# EasyEDA Pro project 工科.eprj

# Schematic Schematic1
Create Date: 2024-07-19; Page Name: P1; Project Name: 工科; Schematic Name: Schematic1; Update Date: 2024-08-10; Company: 嘉立创EDA; Page Size: A4; Version: V1.0
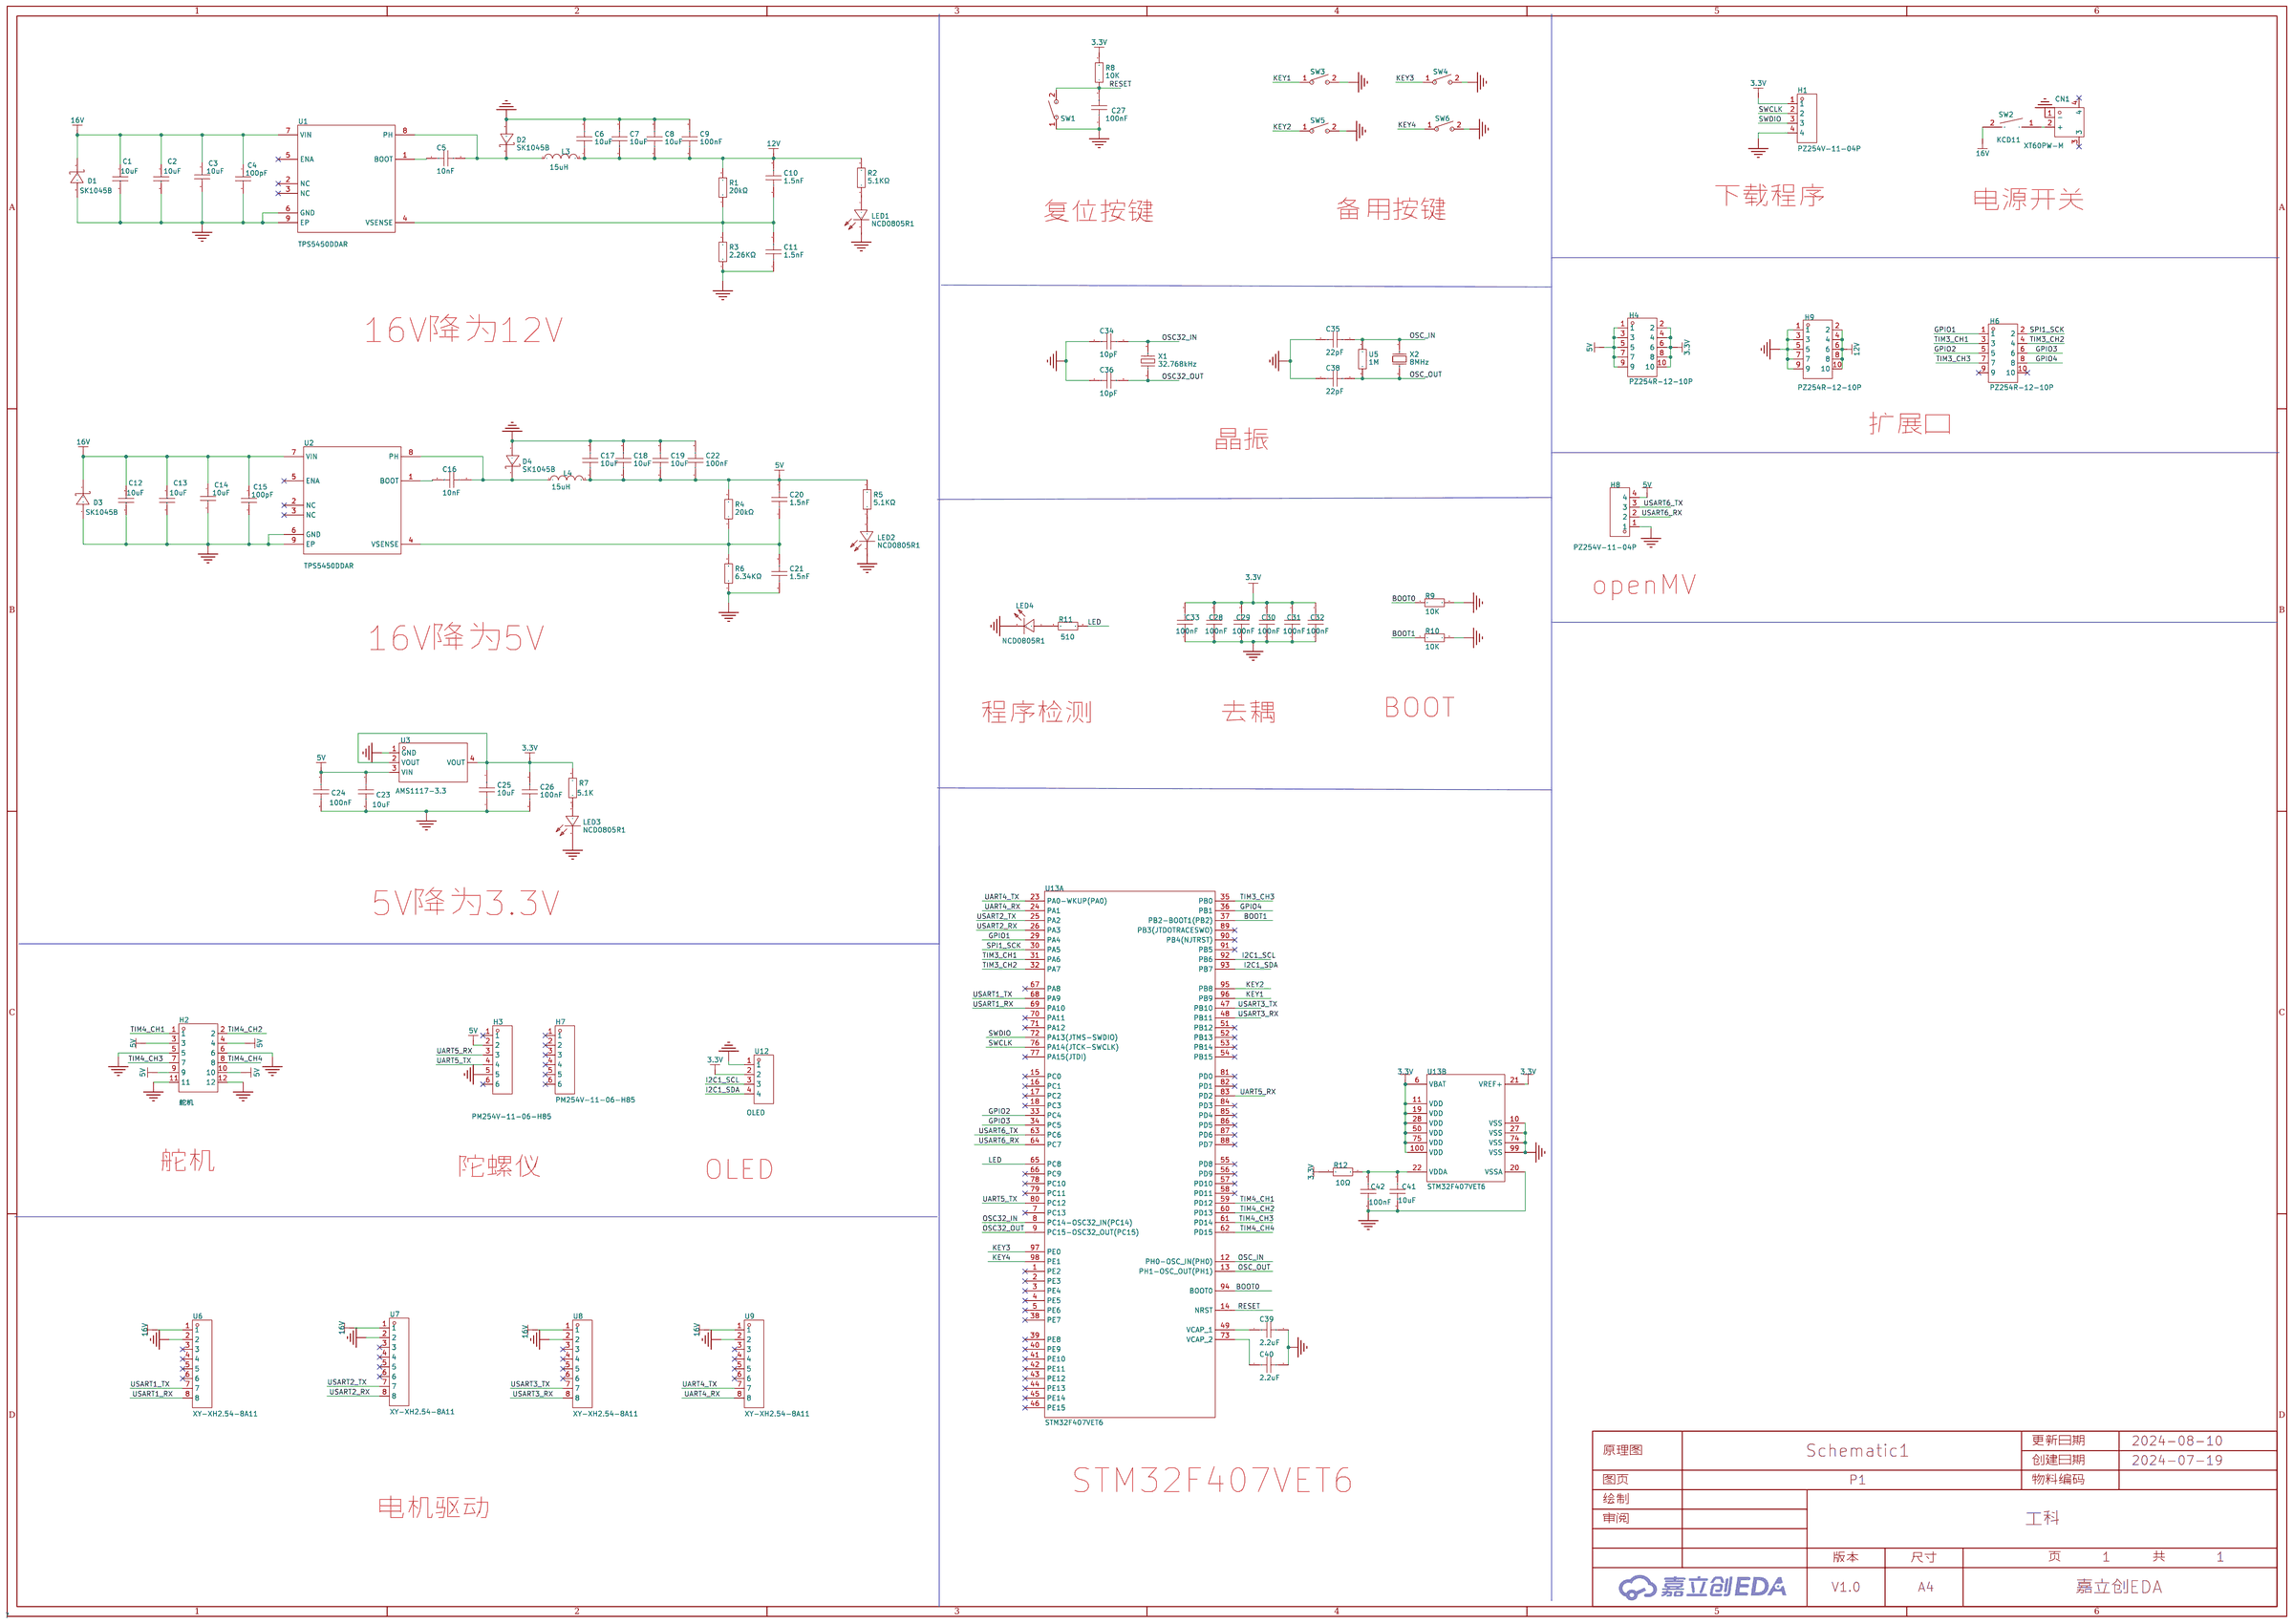
[diagram p0: schematic sheet]

## Parts
C1  10uF  [C0805]
C2  10uF  [C0805]
C3  10uF  [C0805]
C4  100pF  [C0805]
C5  10nF  [C0805]
C6  10uF  [C0805]
C7  10uF  [C0805]
C8  10uF  [C0805]
C9  100nF  [C0805]
C10  1.5nF  [C0805]
C11  1.5nF  [C0805]
C12  10uF  [C0805]
C13  10uF  [C0805]
C14  10uF  [C0805]
C15  100pF  [C0805]
C16  10nF  [C0805]
C17  10uF  [C0805]
C18  10uF  [C0805]
C19  10uF  [C0805]
C20  1.5nF  [C0805]
C21  1.5nF  [C0805]
C22  100nF  [C0805]
C23  10uF  [C0805]
C24  100nF  [C0805]
C25  10uF  [C0805]
C26  100nF  [C0805]
C27  100nF  [C0805]
C28  100nF  [C0805]
C29  100nF  [C0805]
C30  100nF  [C0805]
C31  100nF  [C0805]
C32  100nF  [C0805]
C33  100nF  [C0805]
C34  10pF  [C0805]
C35  22pF  [C0805]
C36  10pF  [C0805]
C38  22pF  [C0805]
C39  2.2uF  [C0805]
C40  2.2uF  [C0805]
C41  10uF  [C0805]
C42  100nF  [C0805]
CN1  XT60PW-M  [CONN-TH_XT60PW-M]
D1  SK1045B  [SMB_L4.6-W3.6-LS5.3-RD]
D2  SK1045B  [SMB_L4.6-W3.6-LS5.3-RD]
D3  SK1045B  [SMB_L4.6-W3.6-LS5.3-RD]
D4  SK1045B  [SMB_L4.6-W3.6-LS5.3-RD]
H1  PZ254V-11-04P  [HDR-TH_4P-P2.54-V-M]
H2  舵机  [HDR-TH_12P-P2.54-H-M-R2-C6-S2.54]
H3  PM254V-11-06-H85  [HDR-TH_6P-P2.54-V-F]
H4  PZ254R-12-10P  [HDR-TH_10P-P2.54-H-M-R2-C5-S2.54]
H6  PZ254R-12-10P  [HDR-TH_10P-P2.54-H-M-R2-C5-S2.54]
H7  PM254V-11-06-H85  [HDR-TH_6P-P2.54-V-F]
H8  PZ254V-11-04P  [HDR-TH_4P-P2.54-V-M]
H9  PZ254R-12-10P  [HDR-TH_10P-P2.54-H-M-R2-C5-S2.54]
L3  15uH  [IND-SMD_L11.5-W10.0_APS10A40]
L4  15uH  [IND-SMD_L11.5-W10.0_APS10A40]
LED1  NCD0805R1  [LED0805-R-RD]
LED2  NCD0805R1  [LED0805-R-RD]
LED3  NCD0805R1  [LED0805-R-RD]
LED4  NCD0805R1  [LED0805-R-RD]
R1  20kΩ  [R0805]
R2  5.1KΩ  [R0805]
R3  2.26KΩ  [R0805]
R4  20kΩ  [R0805]
R5  5.1KΩ  [R0805]
R6  6.34KΩ  [R0805]
R7  5.1K  [R0805]
R8  10K  [R0805]
R9  10K  [R0805]
R10  10K  [R0805]
R11  510  [R0805]
R12  10Ω  [R0805]
SW1  轻触按键3*6*2.5  [SW-SMD_L6.0-W3.6-LS8.0]
SW2  KCD11  [SW-TH_RS601HL-1010011BB]
SW3  轻触按键3*6*2.5  [SW-SMD_L6.0-W3.6-LS8.0]
SW4  轻触按键3*6*2.5  [SW-SMD_L6.0-W3.6-LS8.0]
SW5  轻触按键3*6*2.5  [SW-SMD_L6.0-W3.6-LS8.0]
SW6  轻触按键3*6*2.5  [SW-SMD_L6.0-W3.6-LS8.0]
U1  TPS5450DDAR  [SOP-8_L4.9-W3.9-P1.27-LS6.0-BL-EP]
U2  TPS5450DDAR  [SOP-8_L4.9-W3.9-P1.27-LS6.0-BL-EP]
U3  AMS1117-3.3  [SOT-223-3_L6.5-W3.4-P2.30-LS7.0-BR]
U5  1M  [R0805]
U6  XY-XH2.54-8A11  [HDR-TH_8P-P2.50-V-F-2]
U7  XY-XH2.54-8A11  [HDR-TH_8P-P2.50-V-F-2]
U8  XY-XH2.54-8A11  [HDR-TH_8P-P2.50-V-F-2]
U9  XY-XH2.54-8A11  [HDR-TH_8P-P2.50-V-F-2]
U12  OLED  [HDR-TH_4P-P2.54-H-F-W10.0-N]
U13  STM32F407VET6  [LQFP-100_L14.0-W14.0-P0.50-LS16.0-BL]  (sections 1,2)
X1  32.768kHz  [OSC-SMD_L3.2-W1.5]
X2  8MHz  [HC-49US_L11.5-W4.5-P4.88]

## Library data of the parts
C1-C4 C12-C15 = CC0805KRX7R9BB104: 容值:100nF;精度:±10%;额定电压:50V;材质(温度系数):X7R;; LCSC Part Name: 100nF ±10% 50V; Supplier Part: C49678; Manufacturer: YAGEO(国巨); Supplier Footprint: 0805; JLCPCB Part Class: 基础库; Datasheet: https://atta.szlcsc.com/upload/public/pdf/source/20180224/C181747_15194369449651363981.pdf; Supplier: LCSC; Tolerance: ±10%; Voltage Rated: 50V; Temperature Coefficient: X7R
C5-C11 C16-C36 C38-C42 = CAP_0805: Supplier Footprint: 0805
CN1 = XT60PW-M: 类别:-;类型1:-;; LCSC Part Name: AMASS(艾迈斯)航模插头xt60连接器150公母对接pw锂电池公头 板插卧式XT60PW-M; Supplier Part: C98732; Manufacturer: AMASS(艾迈斯); JLCPCB Part Class: 扩展库; Datasheet: https://atta.szlcsc.com/upload/public/pdf/source/20240118/44A3DCFF53BE25DC65378AFFB21277A4.pdf; Supplier: LCSC; Brand: 艾迈斯; Type: 卧式插头; Colour: 黄色; InterfaceType: 公头
D1-D4 = SK1045B: 二极管配置:独立式;正向压降(Vf):550mV@10A;直流反向耐压(Vr):45V;整流电流:10A;; LCSC Part Name: 电压:45V 电流:10A; Supplier Part: C65017; Manufacturer: MDD(辰达半导体); Supplier Footprint: SMB(DO-214AA); JLCPCB Part Class: 扩展库; Datasheet: https://atta.szlcsc.com/upload/public/pdf/source/20230314/9F031E71083C97B2A85075FA90CCC433.pdf; Supplier: LCSC; Diode Configuration: 独立式; Forward Voltage (Vf@If): 550mV@10A; Reverse Voltage (Vr): 45V; Rectified Current: 10A; Reverse Leakage Current (Ir): 1mA@45V@45V
H1 H8 = PZ254V-11-04P: 插针结构:1x4P;间距:2.54mm;行距:-;圆针/方针:方针;安装类型:直插;排数:单排;总PIN位数:4P;额定电流:3A;额定电压:250V;配合针长度:6mm;塑高:2.5mm;端接针长度:3mm;触头材质:-;工作温度范围:-40℃~+105℃;颜色:黑色;; LCSC Part Name: 间距:2.54mm 1x4P 直插 方针; Supplier Part: C2691448; Manufacturer: XFCN(兴飞); Supplier Footprint: 插件,P=2.54mm; JLCPCB Part Class: 扩展库; Datasheet: https://atta.szlcsc.com/upload/public/pdf/source/20200309/C492403_F9F19131791D08044AD4F84F8E751A34.pdf; Supplier: LCSC; Pin Structure: 1x4P; Pitch: 2.54mm; Circluar Pins/Square Pins: 方针; Mounting Type: 直插; Number of Rows: 单排; Number of Pins: 4P; Current Rating (Max): 3A; Voltage Rating (Max): 250V; Length of Mating Pin: 6mm; Insulation Height: 2.5mm; Length of End Connection Pin: 3mm; Operating Temperature Range: -40℃~+105℃; Color: 黑色
H2 = PZ254R-12-12P: 插针结构:2x6P;间距:2.54mm;行距:2.54mm;圆针/方针:方针;安装类型:弯插;排数:双排;总PIN位数:12P;额定电流:-;额定电压:-;配合针长度:6mm;塑高:2.5mm;触头材质:黄铜;触头镀层:-;工作温度范围:-40℃~+105℃;颜色:黑色;; LCSC Part Name: 间距:2.54mm 2x6P 弯插 方针; Supplier Part: C492434; Manufacturer: XFCN(兴飞); Supplier Footprint: 弯插,P=2.54mm; JLCPCB Part Class: 扩展库; Datasheet: https://atta.szlcsc.com/upload/public/pdf/source/20200309/C492434_8FF69D1295D71AC99A4B0B951ADD15B8.pdf; Supplier: LCSC; Pin Structure: 2x6P; Pitch: 2.54mm; Row Spacing: 2.54mm; Circluar Pins/Square Pins: 方针; Mounting Type: 弯插; Number of Rows: 双排; Number of Pins: 12P; Length of Mating Pin: 6mm; Insulation Height: 2.5mm; Contact Material: 黄铜; Operating Temperature Range: -40℃~+105℃; Color: 黑色
H3 H7 = PM254V-11-06-H85: 插孔结构:1x6P;间距:2.54mm;行距:-;圆孔/方孔:方孔;安装类型:直插;排数:单排;总孔位数:6P;额定电流:3A;额定电压:250V;插孔方向:顶部;塑高:-;工作温度范围:-40℃~+105℃;; LCSC Part Name: 间距:2.54mm 1x6P 直插; Supplier Part: C2832269; Manufacturer: XFCN(兴飞); Supplier Footprint: 插件,P=2.54mm; JLCPCB Part Class: 扩展库; Datasheet: https://atta.szlcsc.com/upload/public/pdf/source/20210514/C2832269_B3EC97736B37C2783BDCE3050AA57447.pdf; Supplier: LCSC; Holes Structure: 1x6P; Pitch: 2.54mm; Circular Hole / Square Hole: 方孔; Mounting Type: 直插; Number of Rows: 单排; Number of Holes: 6P; Current Rating (Max): 3A; Voltage Rating (Max): 250V; Holes Direction: 顶部; Operating Temperature Range: -40℃~+105℃
H4 H6 H9 = PZ254R-12-10P: 插针结构:2x5P;间距:2.54mm;行距:2.54mm;圆针/方针:方针;安装类型:弯插;排数:双排;总PIN位数:10P;额定电流:-;额定电压:-;配合针长度:6mm;塑高:2.5mm;触头材质:黄铜;触头镀层:-;工作温度范围:-40℃~+105℃;颜色:黑色;; LCSC Part Name: 间距:2.54mm 2x5P 弯插 方针; Supplier Part: C492433; Manufacturer: XFCN(兴飞); Supplier Footprint: 弯插,P=2.54mm; JLCPCB Part Class: 扩展库; Datasheet: https://atta.szlcsc.com/upload/public/pdf/source/20200309/C492433_E1DF9BC45CD746DC26B2517D82EEBDA7.pdf; Supplier: LCSC; Pin Structure: 2x5P; Pitch: 2.54mm; Row Spacing: 2.54mm; Circluar Pins/Square Pins: 方针; Mounting Type: 弯插; Number of Rows: 双排; Number of Pins: 10P; Length of Mating Pin: 6mm; Insulation Height: 2.5mm; Contact Material: 黄铜; Operating Temperature Range: -40℃~+105℃; Color: 黑色
L3 L4 = APS10A40M150: 电感值:15uH;精度:±20%;额定电流:6.55A;饱和电流(Isat):7A;; LCSC Part Name: 15uH ±20% 7A; Supplier Part: C253615; Manufacturer: Coilank(驰兴电感); Supplier Footprint: SMD; JLCPCB Part Class: 扩展库; Datasheet: https://atta.szlcsc.com/upload/public/pdf/source/20230512/EB4395A51C83803B0ABA506A98EDA969.pdf; Supplier: LCSC; Tolerance: ±20%; Rated Current: 6.55A; Saturation Current (Isat): 7A; DC Resistance (DCR): 44.5mΩ; Ratings: AEC-Q200
LED1-LED4 = NCD0805R1: 灯头类型:-;发光颜色:红色;正向电压(VF):1.6V~2.6V;功率:65mW;正向电流:20mA;主波长:615nm~630nm;二极管配置:独立二极管;透镜颜色:无色透明透镜;色温:-;发光强度:67mcd~195mcd;发光角度:130°;载带方式:-;工作温度:-30℃~+85℃;; Supplier Part: C84256; Manufacturer: 国星光电; Supplier Footprint: 0805; JLCPCB Part Class: 基础库; Datasheet: https://atta.szlcsc.com/upload/public/pdf/source/20200820/C84256_F0A75A43B3EAD75808600A0514C76B99.pdf; Supplier: LCSC; Emitted Color: 红色; Forward Voltage (VF): 1.6V~2.6V; Power Dissipation: 65mW; Forward Current: 20mA; Dominant Wavelength: 615nm~630nm; Diode Configuration: 独立二极管; Lens Color: 无色透明透镜; Luminous Intensity: 67mcd~195mcd; Viewing Angle: 130°; Operating Temperature: -30℃~+85℃
R1-R12 U5 = Res_0805: Supplier Footprint: 0805
SW1 SW3-SW6 = 轻触按键3*6*2.5: Supplier Part: C9900013040; Supplier Footprint: KEY; JLCPCB Part Class: 扩展库; Supplier: LCSC
SW2 = RS601HL-1010011BB: 带灯:无;引脚样式:焊片;额定电流:3A;额定电压(AC):250V;额定电压(DC):-;电路结构:单刀单掷;机械寿命:1万次;; Supplier Part: C2885782; Manufacturer: HCTL(华灿天禄); Supplier Footprint: 插件; JLCPCB Part Class: 扩展库; Datasheet: https://atta.szlcsc.com/upload/public/pdf/source/20210820/B1970E40D09304D7FA648AE2099FB3E8.pdf; Supplier: LCSC; Switch Length: 15mm; Switch Width: 10.5mm; Switch Height: 11.7mm; Actuator Type: 凹面弯曲; With Lamp: 无; Pin Style: 焊片; Actuator Color: 黑色; Contact Current: 3A; Voltage Rating (AC): 250V; Circuit: 单刀单掷; Mechanical Life: 1万次; Operating Temperature: -25℃~+85℃; Actuator Identifier: - O
U1 U2 = TPS5450DDAR: 功能类型:降压型;输出类型:可调;输入电压:5.5V~36V;输出电压:1.221V~31.32V;输出电流(最大值):5A;; Supplier Part: C114425; Manufacturer: TI(德州仪器); Supplier Footprint: SOP-8-EP-150mil; JLCPCB Part Class: 扩展库; Datasheet: https://www.ti.com/cn/lit/gpn/tps5450; Supplier: LCSC; Function: 降压型; Output Type: 可调; Input Voltage: 5.5V~36V; Output Voltage: 1.221V~31.32V; Output Current (Max): 5A; Switching Frequency: 500kHz; Operating Temperature: -40℃~+125℃@(TJ); Synchronous Rectification: 否; Number of Outputs: 1; Topology: 降压式; Switch tube (built-in/external): 内置
U3 = AMS1117-3.3_C6186: 输出类型:固定;最大输入电压:-;输出电压:3.3V;最大输出电流:1A;电源纹波抑制比(PSRR):72dB@(120Hz);输出极性:正极;; LCSC Part Name: 输出3.3V 1A; Supplier Part: C6186; Manufacturer: AMS; Supplier Footprint: SOT-223; JLCPCB Part Class: 基础库; Datasheet: https://atta.szlcsc.com/upload/public/pdf/source/20180727/C6186_7A095716F0823C02F1997A905E26C086.pdf; Supplier: LCSC; Output Type: 固定; Output Voltage: 3.3V; MAX Output Current: 1A; Power Supply Rejection Ratio (PSRR): 72dB@(120Hz); Dropout Voltage: 1.3V@(800mA); Output Polarity: 正极; Number of Outputs: 1
U6-U9 = XY-XH2.54-8A11: 插针结构:1x8P;间距:2.54mm;安装方式:直插;总PIN数:8P;排数:1;每排PIN数:8;行距:2.54mm;额定电流:2A;工作温度范围:-25℃~+85℃;; LCSC Part Name: 1x8P 间距:2.54mm 直插; Supplier Part: C19271374; Manufacturer: XYECONN(辛译); Supplier Footprint: 插件,P=2.54mm; Datasheet: https://atta.szlcsc.com/upload/public/pdf/source/20231124/FE6C94FEE8E92153564DB6B2026F1152.pdf; Supplier: LCSC; Pins Structure: 1x8P; Pitch: 2.54mm; Mounting Style: 直插; Number of Pins: 8P; Number of Rows: 1; Number of PINs Per Row: 8; Row Spacing: 2.54mm; Current Rating (Max): 2A; Operating Temperature Range: -25℃~+85℃
U12 = PM254-1-04-W-8.5: 插孔结构:1x4P;间距:2.54mm;行距:-;圆孔/方孔:方孔;安装类型:弯插;排数:单排;总孔位数:4P;额定电流:3A;额定电压:-;插孔方向:侧面;塑高:8.5mm;触头材质:铜合金;工作温度范围:-40℃~+105℃;焊接温度(最大值):260℃@5S;; LCSC Part Name: 1x4P 间距:2.54mm 弯插; Supplier Part: C2897386; Manufacturer: HCTL(华灿天禄); Supplier Footprint: 弯插,P=2.54mm; JLCPCB Part Class: 扩展库; Datasheet: https://atta.szlcsc.com/upload/public/pdf/source/20230609/7BA40A3D721268A082DCDEAD4C99131B.pdf; Supplier: LCSC; Holes Structure: 1x4P; Pitch: 2.54mm; Circular Hole / Square Hole: 方孔; Mounting Type: 弯插; Number of Rows: 单排; Number of Holes: 4P; Current Rating (Max): 3A; Holes Direction: 侧面; Insulation Height: 8.5mm; Contact Material: 铜合金; Operating Temperature Range: -40℃~+105℃; Soldering Temperature(Max): 260℃@5S
U13 = STM32F407VET6: CPU内核:CM4;程序存储容量:512KB;RAM总容量:192KB;GPIO端口数量:82;工作电压范围:1.8V~3.6V;CPU最大主频:168MHz;程序存储器类型:FLASH;; Supplier Part: C28730; Manufacturer: ST(意法半导体); Supplier Footprint: LQFP-100(14x14); JLCPCB Part Class: 扩展库; Datasheet: https://atta.szlcsc.com/upload/public/pdf/source/20140801/1457707197138.pdf; Supplier: LCSC; CPU Core: CM4; Program Storage Size: 512KB; RAM Size: 192KB; GPIO Ports Number: 82; Operating Voltage Range: 1.8V~3.6V; CPU Maximum Speed: 168MHz; Program Memory Type: FLASH; Operating Temperature Range: -40℃~+85℃; ADC (Bit): 12bit; DAC (Bit): 12bit; Universal Serial Bus: 有; Peripheral/Function: DMA；LCD/LED驱动；PWM; Watchdog: 有; Infrared Data Association: 有; Low-Voltage Detect: 有; LCD Module: 有; Direct Memory Access: 有; Internal Oscillator: 有
X1 = X321532768KGD2SI: 晶振类型:贴片晶振;频率:32.768kHz;常温频差:±20ppm;外接负载电容:12.5pF;频率稳定度(全温):-;; LCSC Part Name: 32.768kHz ±20ppm 12.5pF; Supplier Part: C620155; Manufacturer: YXC(扬兴晶振); Supplier Footprint: SMD3215-2P; JLCPCB Part Class: 扩展库; Datasheet: https://atta.szlcsc.com/upload/public/pdf/source/20240329/3A7650FD985DD0DE85694D3785AB4916.pdf; Supplier: LCSC; Crystal Type: 贴片晶振; Normal temperature Frequency Tolerance: ±20ppm; External load capacitor: 12.5pF; Operating Temperature: -40℃~+85℃
X2 = TAXD8M2GLFBET2T: 晶振类型:直插晶振;频率:8MHz;常温频差:±30ppm;外接负载电容:20pF;频率稳定度(全温):±30ppm;; LCSC Part Name: 8MHz ±30ppm 20pF; Supplier Part: C107425; Manufacturer: YJX(雅晶鑫); Supplier Footprint: HC-49S; JLCPCB Part Class: 扩展库; Datasheet: https://atta.szlcsc.com/upload/public/pdf/source/20170914/C127676_1505359415156967690.pdf; Supplier: LCSC; Crystal Type: 直插晶振; Normal temperature Frequency Tolerance: ±30ppm; External load capacitor: 20pF; Frequency Stability(Full temperature range): ±30ppm; Equivalent Series Resistance (ESR): 80Ω; Operating Temperature: -20℃~+70℃

## Nets
3.3V: C25.2 C26.2 C28.2 C29.2 C30.2 C31.2 C32.2 C33.2 H1.1 H4.2 H4.4 H4.6 H4.8 H4.10 R7.2 R8.2 R12.1 U3.2(VOUT) U3.4(VOUT) U12.2 U13.6(VBAT) U13.11(VDD) U13.19(VDD) U13.21(VREF+) U13.28(VDD) U13.50(VDD) U13.75(VDD) U13.100(VDD)
5V: C17.1 C18.1 C19.1 C20.2 C22.1 C23.1 C24.1 H2.3 H2.4 H2.9 H2.10 H3.2 H4.1 H4.3 H4.5 H4.7 H4.9 H8.4 L4.2 R4.2 R5.2 U3.3(VIN)
12V: C6.1 C7.1 C8.1 C9.1 C10.2 H9.2 H9.4 H9.6 H9.8 H9.10 L3.2 R1.2 R2.2
16V: C1.1 C2.1 C3.1 C4.1 C12.1 C13.1 C14.1 C15.1 D1.1(K) D3.1(K) SW2.2 U1.7(VIN) U2.7(VIN) U6.1 U7.1 U8.1 U9.1
GND: C1.2 C2.2 C3.2 C4.2 C6.2 C7.2 C8.2 C9.2 C11.1 C12.2 C13.2 C14.2 C15.2 C17.2 C18.2 C19.2 C21.1 C22.2 C23.2 C24.2 C25.1 C26.1 C27.1 C28.1 C29.1 C30.1 C31.1 C32.1 C33.1 C34.2 C35.2 C36.1 C38.1 C39.2 C40.2 C41.1 C42.1 CN1.1(-) D1.2(A) D2.2(A) D3.2(A) D4.2(A) H1.4 H2.5 H2.6 H2.11 H2.12 H3.5 H8.1 H9.1 H9.3 H9.5 H9.7 H9.9 LED1.2(-) LED2.2(-) LED3.2(-) LED4.2(-) R3.1 R6.1 R9.2 R10.2 SW1.1 SW3.2 SW4.2 SW5.2 SW6.2 U1.6(GND) U1.9(EP) U2.6(GND) U2.9(EP) U3.1(GND) U6.2 U7.2 U8.2 U9.2 U12.1 U13.10(VSS) U13.20(VSSA) U13.27(VSS) U13.74(VSS) U13.99(VSS)
BOOT0: R9.1 U13.94(BOOT0)
BOOT1: R10.1 U13.37(PB2-BOOT1(PB2))
GPIO1: H6.1 U13.29(PA4)
GPIO2: H6.5 U13.33(PC4)
GPIO3: H6.6 U13.34(PC5)
GPIO4: H6.8 U13.36(PB1)
I2C1_SCL: U12.3 U13.92(PB6)
I2C1_SDA: U12.4 U13.93(PB7)
KEY1: SW3.1 U13.96(PB9)
KEY2: SW5.1 U13.95(PB8)
KEY3: SW4.1 U13.97(PE0)
KEY4: SW6.1 U13.98(PE1)
LED: R11.2 U13.65(PC8)
OSC32_IN: C34.1 U13.8(PC14-OSC32_IN(PC14)) X1.2
OSC32_OUT: C36.2 U13.9(PC15-OSC32_OUT(PC15)) X1.1
OSC_IN: C35.1 U5.2 U13.12(PH0-OSC_IN(PH0)) X2.2(OSC2)
OSC_OUT: C38.2 U5.1 U13.13(PH1-OSC_OUT(PH1)) X2.1(OSC1)
RESET: C27.2 R8.1 SW1.2 U13.14(NRST)
SPI1_SCK: H6.2 U13.30(PA5)
SWCLK: H1.2 U13.76(PA14(JTCK-SWCLK))
SWDIO: H1.3 U13.72(PA13(JTMS-SWDIO))
TIM3_CH1: H6.3 U13.31(PA6)
TIM3_CH2: H6.4 U13.32(PA7)
TIM3_CH3: H6.7 U13.35(PB0)
TIM4_CH1: H2.1 U13.59(PD12)
TIM4_CH2: H2.2 U13.60(PD13)
TIM4_CH3: H2.7 U13.61(PD14)
TIM4_CH4: H2.8 U13.62(PD15)
UART4_RX: U9.8 U13.24(PA1)
UART4_TX: U9.7 U13.23(PA0-WKUP(PA0))
UART5_RX: H3.3 U13.83(PD2)
UART5_TX: H3.4 U13.80(PC12)
USART1_RX: U6.8 U13.69(PA10)
USART1_TX: U6.7 U13.68(PA9)
USART2_RX: U7.8 U13.26(PA3)
USART2_TX: U7.7 U13.25(PA2)
USART3_RX: U8.8 U13.48(PB11)
USART3_TX: U8.7 U13.47(PB10)
USART6_RX: H8.2 U13.64(PC7)
USART6_TX: H8.3 U13.63(PC6)
$1N1025: C5.1 U1.1(BOOT)
$1N1287: C5.2 D2.1(K) L3.1 U1.8(PH)
$1N2006: C10.1 C11.2 R1.1 R3.2 U1.4(VSENSE)
$1N2167: LED1.1(+) R2.1
$1N3876: C16.2 U2.1(BOOT)
$1N3877: C16.1 D4.1(K) L4.1 U2.8(PH)
$1N3883: C20.1 C21.2 R4.1 R6.2 U2.4(VSENSE)
$1N3893: LED2.1(+) R5.1
$1N6099: LED3.1(+) R7.1
$1N9952: CN1.2(+) SW2.1
$1N10073: LED4.1(+) R11.1
$1N17348: C39.1 U13.49(VCAP_1)
$1N17426: C40.1 U13.73(VCAP_2)
$1N39852: C41.2 C42.2 R12.2 U13.22(VDDA)

Not connected (* = marked no-connect by the designer): CN1 3* 4*; H3 1* 6*; H6 9* 10*; H7 1* 2* 3* 4* 5* 6*; U1 2(NC)* 3(NC)* 5(ENA)*; U2 2(NC)* 3(NC)* 5(ENA)*; U6 3* 4* 5* 6*; U7 3* 4* 5* 6*; U8 3* 4* 5* 6*; U9 3* 4* 5* 6*; U13 1(PE2)* 2(PE3)* 3(PE4)* 4(PE5)* 5(PE6)* 7(PC13)* 15(PC0)* 16(PC1)* 17(PC2)* 18(PC3)* 38(PE7)* 39(PE8)* 40(PE9)* 41(PE10)* 42(PE11)* 43(PE12)* 44(PE13)* 45(PE14)* 46(PE15)* 51(PB12)* 52(PB13)* 53(PB14)* 54(PB15)* 55(PD8)* 56(PD9)* 57(PD10)* 58(PD11)* 66(PC9)* 67(PA8)* 70(PA11)* 71(PA12)* 77(PA15(JTDI))* 78(PC10)* 79(PC11)* 81(PD0)* 82(PD1)* 84(PD3)* 85(PD4)* 86(PD5)* 87(PD6)* 88(PD7)* 89(PB3(JTDOTRACESWO))* 90(PB4(NJTRST))* 91(PB5)*

## Notes on the sheet
- 下载程序
- 电源开关
- 复位按键
- 备用按键
- 16V降为12V
- 扩展口
- 晶振
- openMV
- 16V降为5V
- BOOT
- 程序检测
- 去耦
- 5V降为3.3V
- 舵机
- 陀螺仪
- OLED
- STM32F407VET6
- 电机驱动

# Board PCB1
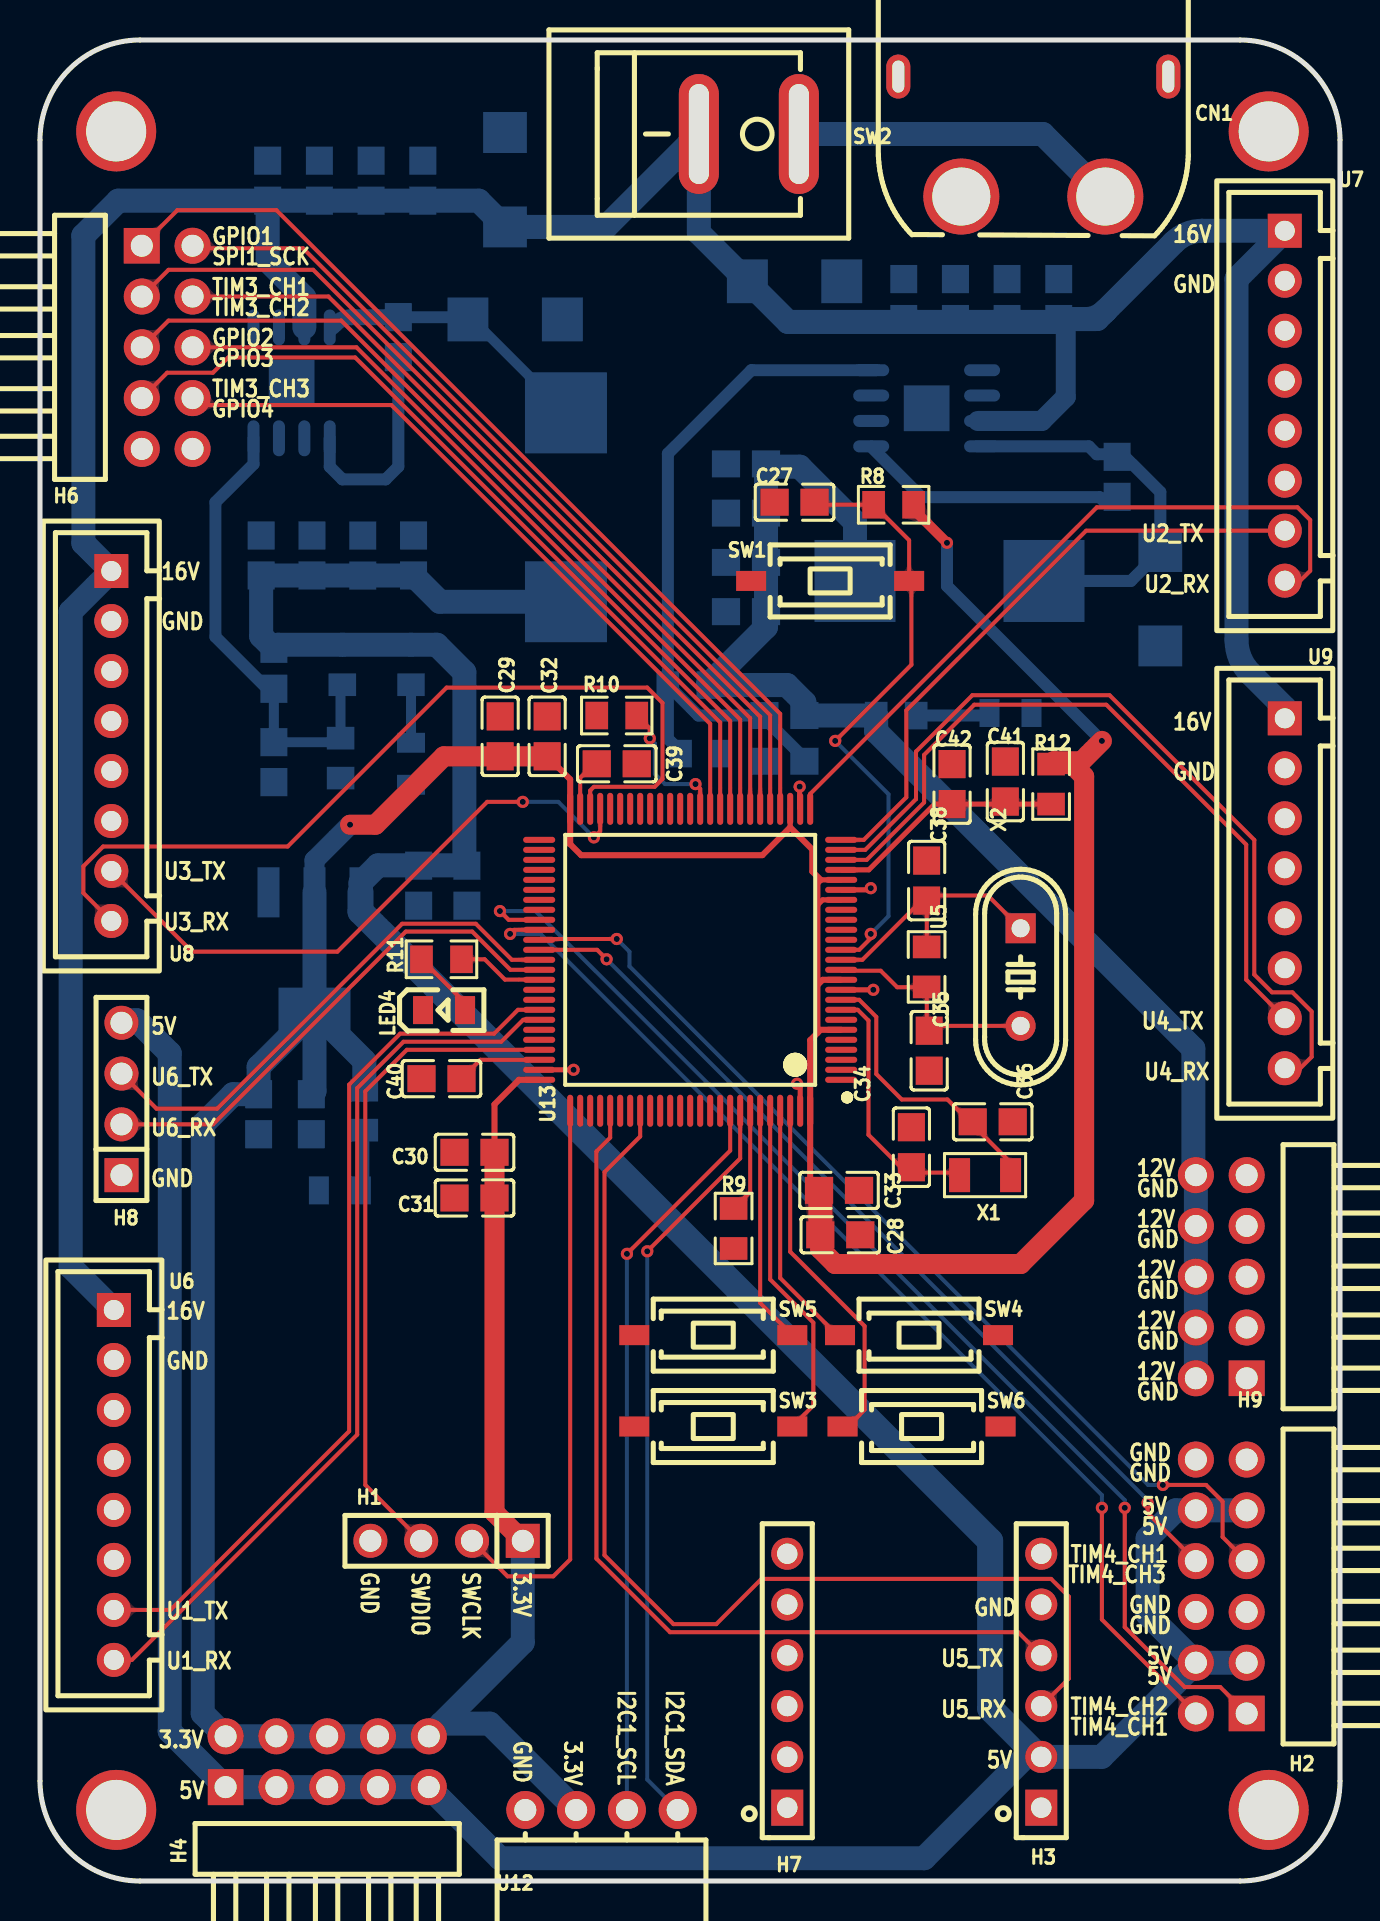
[diagram p1: board, top side]
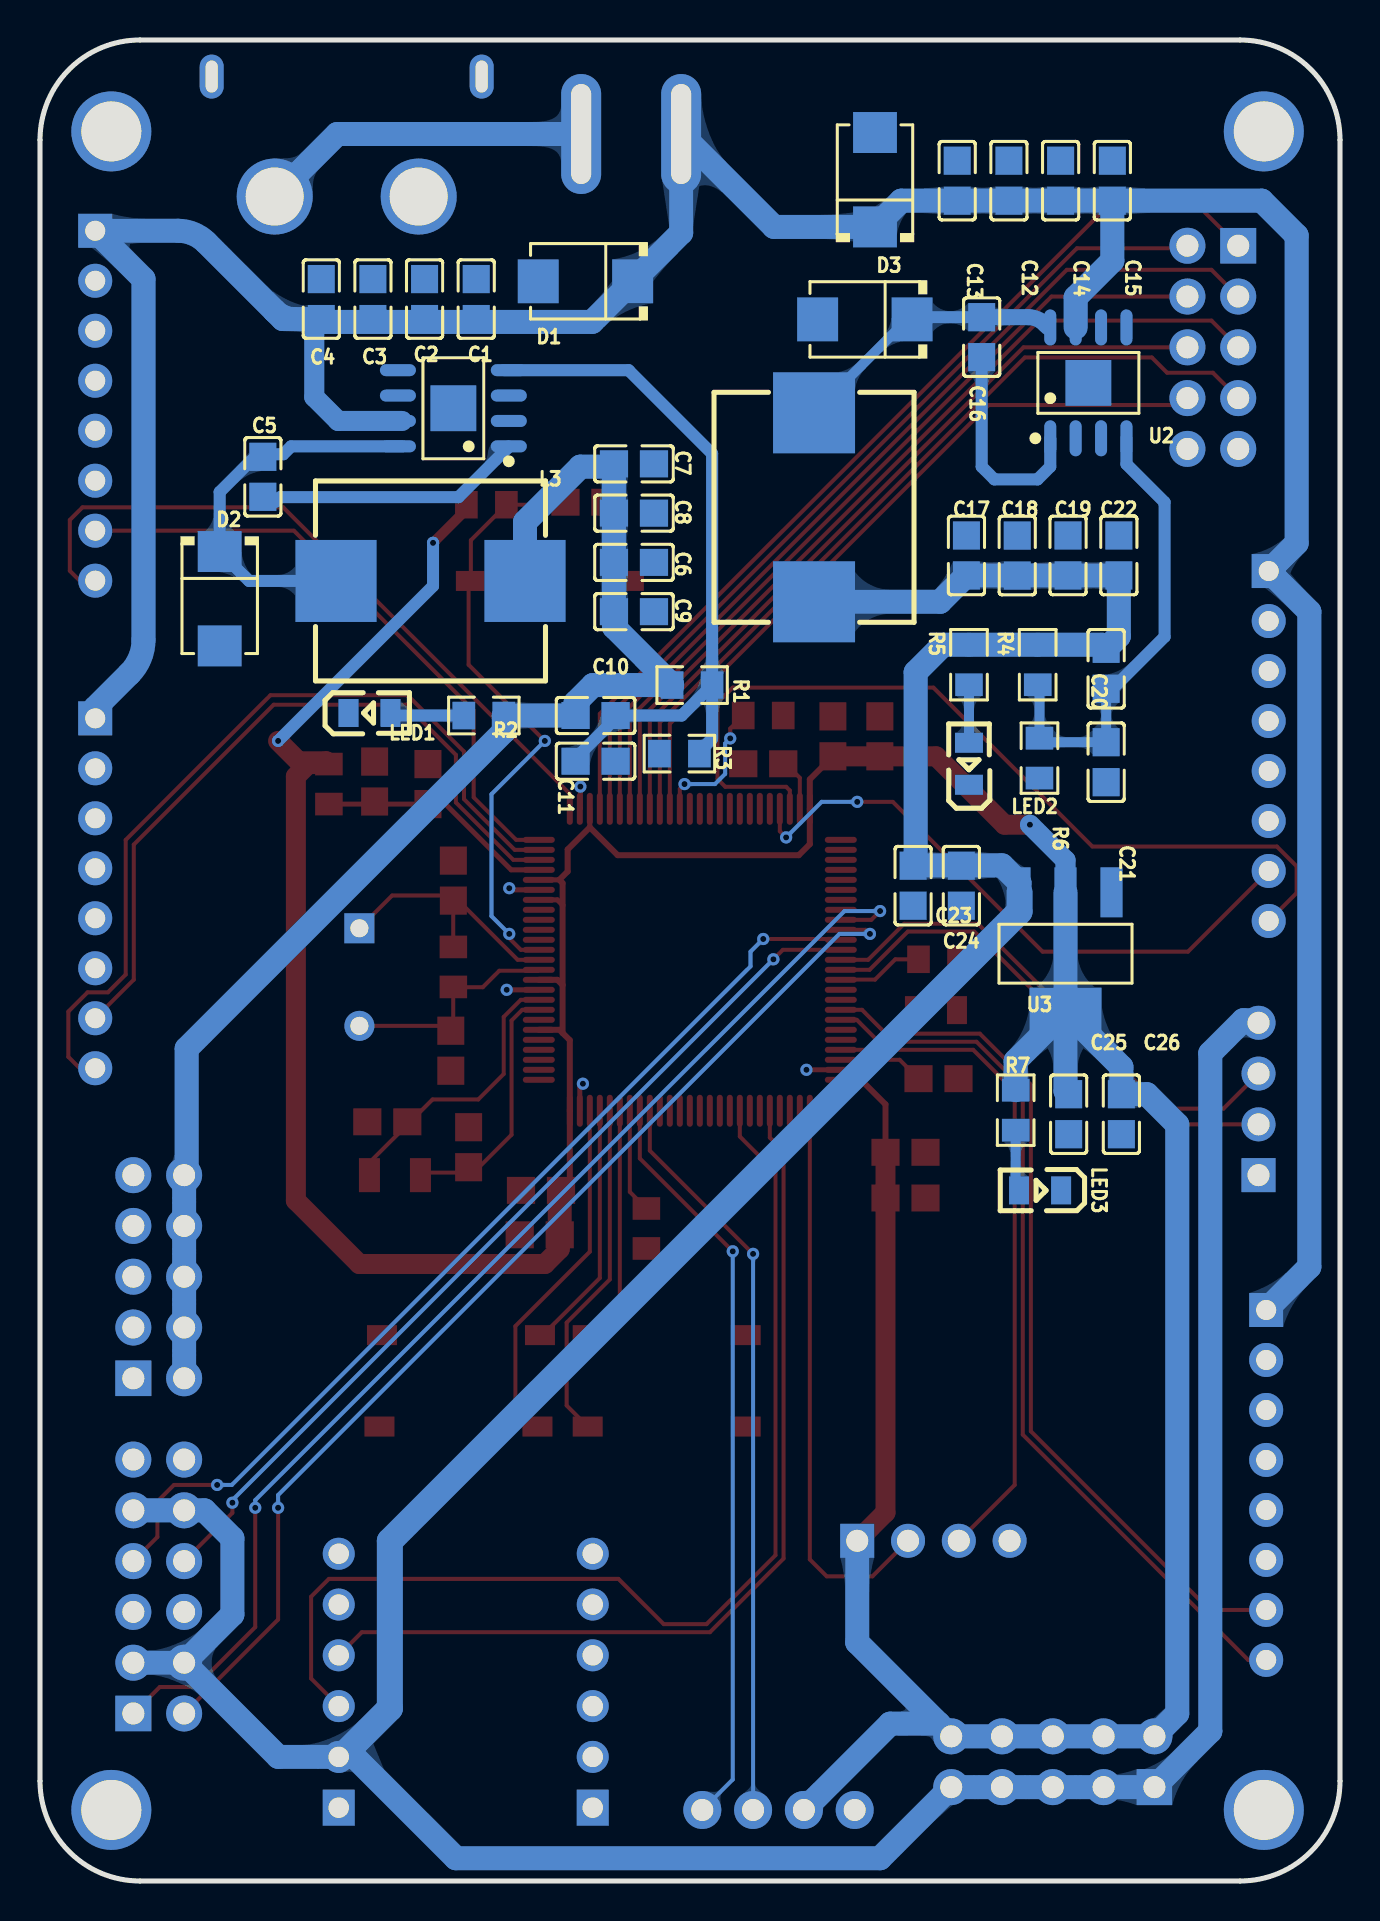
[diagram p2: board, bottom side, seen from below]

Outline 65 x 92.07 mm; copper layers: Top Layer, Bottom Layer. Coordinates in mm from the lower left corner of the outline.
Outline path: 0,87.07 0,5 arc(1.46,1.46) 5,0 60,0 arc(63.54,1.46) 65,5 65,87.07 arc(63.54,90.61) 60,92.07 5,92.07 arc(1.46,90.61) 0,87.07
Stack: Top Layer 0.035mm - / Dielectric1 1.51mm FR4 er 4.5 / Bottom Layer 0.035mm -

## Design rules (mm)
net 16V: power
net GND: power
net 12V: power
net 5V: power
net 3.3V: power
net $1N9952: power
template: 自定义配置
spacing copperThickness1oz (default): track to track 0.191, other pairs 0.191 to 0.191
spacing copperThickness2oz: track to track 0.203, other pairs 0.152 to 0.3
track width copperThickness1oz (default): min 0.201, default 0.201, max 1.199
track width copperThickness2oz: min 0.203, default 0.254, max 2.54
track width power: min 0.249, default 0.249, max 2.54
differential pair differentialPair (default): width min 0.152, default 0.152, max 2.54; gap min 0.152, default 0.152
via viaSize (default): diameter min 0.61, default 0.61, max 10; hole min 0.305, default 0.305, max 6.299
net class power uses power
net 16V uses power
net GND uses power
net 12V uses power
net 5V uses power
net 3.3V uses power
net $1N9952 uses power

## Placement (name value [footprint] x y rotation side)
C1  10uF  [C0805]  43.19 79.12 90 bottom
C2  10uF  [C0805]  45.77 79.12 90 bottom
C3  10uF  [C0805]  48.35 79.12 90 bottom
C4  100pF  [C0805]  50.94 79.12 90 bottom
C5  10nF  [C0805]  53.86 70.23 90 bottom
C6  10uF  [C0805]  35.3 65.95 180 bottom
C7  10uF  [C0805]  35.3 70.88 180 bottom
C8  10uF  [C0805]  35.3 68.41 180 bottom
C9  100nF  [C0805]  35.3 63.48 180 bottom
C10  1.5nF  [C0805]  37.22 58.29 0 bottom
C11  1.5nF  [C0805]  37.22 56 0 bottom
C12  10uF  [C0805]  16.55 85.04 90 bottom
C13  10uF  [C0805]  19.14 85.04 90 bottom
C14  10uF  [C0805]  13.97 85.04 90 bottom
C15  100pF  [C0805]  11.38 85.04 90 bottom
C16  10nF  [C0805]  17.92 77.21 270 bottom
C17  10uF  [C0805]  18.68 66.29 90 bottom
C18  10uF  [C0805]  16.14 66.29 90 bottom
C19  10uF  [C0805]  13.6 66.29 90 bottom
C20  1.5nF  [C0805]  11.69 60.63 90 bottom
C21  1.5nF  [C0805]  11.69 55.96 90 bottom
C22  100nF  [C0805]  11.06 66.29 90 bottom
C23  10uF  [C0805]  21.35 49.78 270 bottom
C24  100nF  [C0805]  18.93 49.78 270 bottom
C25  10uF  [C0805]  13.57 38.35 90 bottom
C26  100nF  [C0805]  10.93 38.35 90 bottom
C27  100nF  [C0805]  37.73 68.96 0 top
C28  100nF  [C0805]  40.01 32.32 180 top
C29  100nF  [C0805]  23.01 57.25 270 top
C30  100nF  [C0805]  21.73 36.45 0 top
C31  100nF  [C0805]  21.73 34.16 0 top
C32  100nF  [C0805]  25.36 57.25 270 top
C33  100nF  [C0805]  39.95 34.54 180 top
C34  10pF  [C0805]  43.57 36.7 90 top
C35  22pF  [C0805]  44.46 41.53 270 top
C36  10pF  [C0805]  47.63 37.97 180 top
C38  22pF  [C0805]  44.33 50.03 270 top
C39  2.2uF  [C0805]  28.84 55.88 0 top
C40  2.2uF  [C0805]  20.08 40.13 180 top
C41  10uF  [C0805]  48.27 54.99 270 top
C42  100nF  [C0805]  45.6 54.86 270 top
CN1  XT60PW-M  [CONN-TH_XT60PW-M]  49.67 87.25 270 top
D1  SK1045B  [SMB_L4.6-W3.6-LS5.3-RD]  37.73 80.01 0 bottom
D2  SK1045B  [SMB_L4.6-W3.6-LS5.3-RD]  56.02 64.13 270 bottom
D3  SK1045B  [SMB_L4.6-W3.6-LS5.3-RD]  23.25 85.09 90 bottom
D4  SK1045B  [SMB_L4.6-W3.6-LS5.3-RD]  23.76 78.1 0 bottom
H1  PZ254V-11-04P  [HDR-TH_4P-P2.54-V-M]  20.33 17.01 180 top
H2  舵机  [HDR-TH_12P-P2.54-H-M-R2-C6-S2.54]  59.06 14.73 90 top
H3  PM254V-11-06-H85  [HDR-TH_6P-P2.54-V-F]  50.06 10.02 90 top
H4  PZ254R-12-10P  [HDR-TH_10P-P2.54-H-M-R2-C5-S2.54]  14.36 5.97 0 top
H6  PZ254R-12-10P  [HDR-TH_10P-P2.54-H-M-R2-C5-S2.54]  6.36 76.7 270 top
H7  PM254V-11-06-H85  [HDR-TH_6P-P2.54-V-F]  37.36 10.02 90 top
H8  PZ254V-11-04P  [HDR-TH_4P-P2.54-V-M]  4.07 39.11 90 top
H9  PZ254R-12-10P  [HDR-TH_10P-P2.54-H-M-R2-C5-S2.54]  59.06 30.22 90 top
L3  15uH  [IND-SMD_L11.5-W10.0_APS10A40]  45.48 65.02 180 bottom
L4  15uH  [IND-SMD_L11.5-W10.0_APS10A40]  26.3 68.7 270 bottom
LED1  NCD0805R1  [LED0805-R-RD]  48.52 58.42 180 bottom
LED2  NCD0805R1  [LED0805-R-RD]  18.55 55.88 90 bottom
LED3  NCD0805R1  [LED0805-R-RD]  14.99 34.54 0 bottom
LED4  NCD0805R1  [LED0805-R-RD]  20.2 43.56 0 top
NOREF  -  [Pad_e99]  3.81 3.56 0 top
NOREF#2  -  [Pad_e385]  3.81 87.5 0 top
NOREF#3  -  [Pad_e93]  61.43 3.56 0 top
NOREF#4  -  [Pad_e386]  61.43 87.5 0 top
R1  20kΩ  [R0805]  32.39 59.81 0 bottom
R2  5.1KΩ  [R0805]  42.81 58.29 180 bottom
R3  2.26KΩ  [R0805]  33.03 56.38 180 bottom
R4  20kΩ  [R0805]  15.12 60.83 90 bottom
R5  5.1KΩ  [R0805]  18.55 60.83 90 bottom
R6  6.34KΩ  [R0805]  15.03 56.16 90 bottom
R7  5.1K  [R0805]  16.22 38.55 90 bottom
R8  10K  [R0805]  42.68 68.83 0 top
R9  10K  [R0805]  34.68 32.64 270 top
R10  10K  [R0805]  28.84 58.29 180 top
R11  510  [R0805]  20.08 46.1 0 top
R12  10Ω  [R0805]  50.55 54.86 270 top
SW1  轻触按键3*6*2.5  [SW-SMD_L6.0-W3.6-LS8.0]  39.51 65.02 0 top
SW2  KCD11  [SW-TH_RS601HL-1010011BB]  35.44 87.37 180 top
SW3  轻触按键3*6*2.5  [SW-SMD_L6.0-W3.6-LS8.0]  33.66 22.73 180 top
SW4  轻触按键3*6*2.5  [SW-SMD_L6.0-W3.6-LS8.0]  43.95 27.3 0 top
SW5  轻触按键3*6*2.5  [SW-SMD_L6.0-W3.6-LS8.0]  33.66 27.3 180 top
SW6  轻触按键3*6*2.5  [SW-SMD_L6.0-W3.6-LS8.0]  44.08 22.73 0 top
U1  TPS5450DDAR  [SOP-8_L4.9-W3.9-P1.27-LS6.0-BL-EP]  44.33 73.66 90 bottom
U2  TPS5450DDAR  [SOP-8_L4.9-W3.9-P1.27-LS6.0-BL-EP]  12.58 74.93 180 bottom
U3  AMS1117-3.3  [SOT-223-3_L6.5-W3.4-P2.30-LS7.0-BR]  13.73 46.48 90 bottom
U5  1M  [R0805]  44.33 45.72 270 top
U6  XY-XH2.54-8A11  [HDR-TH_8P-P2.50-V-F-2]  3.69 19.81 270 top
U7  XY-XH2.54-8A11  [HDR-TH_8P-P2.50-V-F-2]  62.24 73.78 270 top
U8  XY-XH2.54-8A11  [HDR-TH_8P-P2.50-V-F-2]  3.56 56.77 270 top
U9  XY-XH2.54-8A11  [HDR-TH_8P-P2.50-V-F-2]  62.24 49.4 270 top
U12  OLED  [HDR-TH_4P-P2.54-H-F-W10.0-N]  28.08 3.55 0 top
U13  STM32F407VET6  [LQFP-100_L14.0-W14.0-P0.50-LS16.0-BL]  32.51 46.07 90 top
X1  32.768kHz  [OSC-SMD_L3.2-W1.5]  47.25 35.3 180 top
X2  8MHz  [HC-49US_L11.5-W4.5-P4.88]  49.03 45.21 270 top

## Footprints (pads in the part's own frame, mm; a bottom-side part is the same pattern mirrored in y, then rotated)
C0805
  rect 1.41x1.35 smd: 1(-1,0) 2(1,0)
CONN-TH_XT60PW-M
  round 3.8 hole 2.9: 1(3,-3.6) 2(3,3.6)
  oval 2.2x1.2 hole 1.6x0.6: 3(-3,6.75) 4(-3,-6.75)
HC-49US_L11.5-W4.5-P4.88
  rect 1.5x1.5 hole 0.9: 1(-2.44,0)
  round 1.5 hole 0.9: 2(2.44,0)
HDR-TH_4P-P2.54-H-F-W10.0-N
  round 1.9 hole 1.1: 1(-3.81,0) 2(-1.27,0) 3(1.27,0) 4(3.81,0)
HDR-TH_4P-P2.54-V-M
  rect 1.7x1.7 hole 1.1: 1(-3.81,0)
  round 1.7 hole 1.1: 2(-1.27,0) 3(1.27,0) 4(3.81,0)
HDR-TH_6P-P2.54-V-F
  rect 1.8x1.6 hole 1.02: 1(-6.35,0)
  round 1.6 hole 1.02: 2(-3.81,0) 3(-1.27,0) 4(1.27,0) 5(3.81,0) 6(6.35,0)
HDR-TH_8P-P2.50-V-F-2
  rect 1.7x1.7 hole 1: 1(-8.75,0)
  round 1.7 hole 1: 2(-6.25,0) 3(-3.75,0) 4(-1.25,0) 5(1.25,0) 6(3.75,0) 7(6.25,0) 8(8.75,0)
HDR-TH_10P-P2.54-H-M-R2-C5-S2.54
  rect 1.778x1.8 hole 1.1: 1(-5.08,-1.27)
  round 1.8 hole 1.1: 2(-5.08,1.27) 3(-2.54,-1.27) 4(-2.54,1.27) 5(0,-1.27) 6(0,1.27) 7(2.54,-1.27) 8(2.54,1.27) 9(5.08,-1.27) 10(5.08,1.27)
HDR-TH_12P-P2.54-H-M-R2-C6-S2.54
  rect 1.778x1.8 hole 1.1: 1(-6.35,-1.27)
  round 1.8 hole 1.1: 2(-6.35,1.27) 3(-3.81,-1.27) 4(-3.81,1.27) 5(-1.27,-1.27) 6(-1.27,1.27) 7(1.27,-1.27) 8(1.27,1.27) 9(3.81,-1.27) 10(3.81,1.27) 11(6.35,-1.27) 12(6.35,1.27)
IND-SMD_L11.5-W10.0_APS10A40
  rect 4.05x4.1 smd: 1(-4.725,0) 2(4.725,0)
LED0805-R-RD
  rect 1x1.399 smd: 1(1.05,0) 2(-1.05,0)
LQFP-100_L14.0-W14.0-P0.50-LS16.0-BL
  oval 0.3x1.6 smd: 1(-6,-7.55) 2(-5.5,-7.55) 3(-5,-7.55) 4(-4.5,-7.55) 5(-4,-7.55) 6(-3.5,-7.55) 7(-3,-7.55) 8(-2.5,-7.55) 9(-2,-7.55) 10(-1.5,-7.55) 11(-1,-7.55) 12(-0.5,-7.55) 13(0,-7.55) 14(0.5,-7.55) 15(1,-7.55) 16(1.5,-7.55) 17(2,-7.55) 18(2.5,-7.55) 19(3,-7.55) 20(3.5,-7.55) 21(4,-7.55) 22(4.5,-7.55) 23(5,-7.55) 24(5.5,-7.55) 25(6,-7.55) 51(6,7.55) 52(5.5,7.55) 53(5,7.55) 54(4.5,7.55) 55(4,7.55) 56(3.5,7.55) 57(3,7.55) 58(2.5,7.55) 59(2,7.55) 60(1.5,7.55) 61(1,7.55) 62(0.5,7.55) 63(0,7.55) 64(-0.5,7.55) 65(-1,7.55) 66(-1.5,7.55) 67(-2,7.55) 68(-2.5,7.55) 69(-3,7.55) 70(-3.5,7.55) 71(-4,7.55) 72(-4.5,7.55) 73(-5,7.55) 74(-5.5,7.55) 75(-6,7.55)
  oval 1.6x0.3 smd: 26(7.55,-6) 27(7.55,-5.5) 28(7.55,-5) 29(7.55,-4.5) 30(7.55,-4) 31(7.55,-3.5) 32(7.55,-3) 33(7.55,-2.5) 34(7.55,-2) 35(7.55,-1.5) 36(7.55,-1) 37(7.55,-0.5) 38(7.55,0) 39(7.55,0.5) 40(7.55,1) 41(7.55,1.5) 42(7.55,2) 43(7.55,2.5) 44(7.55,3) 45(7.55,3.5) 46(7.55,4) 47(7.55,4.5) 48(7.55,5) 49(7.55,5.5) 50(7.55,6) 76(-7.55,6) 77(-7.55,5.5) 78(-7.55,5) 79(-7.55,4.5) 80(-7.55,4) 81(-7.55,3.5) 82(-7.55,3) 83(-7.55,2.5) 84(-7.55,2) 85(-7.55,1.5) 86(-7.55,1) 87(-7.55,0.5) 88(-7.55,0) 89(-7.55,-0.5) 90(-7.55,-1) 91(-7.55,-1.5) 92(-7.55,-2) 93(-7.55,-2.5) 94(-7.55,-3) 95(-7.55,-3.5) 96(-7.55,-4) 97(-7.55,-4.5) 98(-7.55,-5) 99(-7.55,-5.5) 100(-7.55,-6)
OSC-SMD_L3.2-W1.5
  rect 1.05x1.7 smd: 1(-1.275,0) 2(1.275,0)
Pad_e93
  round 4 hole 3: 101(0,0)
Pad_e99
  round 4 hole 3: 101(0,0)
Pad_e385
  round 4 hole 3: 102(0,0)
Pad_e386
  round 4 hole 3: 103(0,0)
R0805
  rect 1.133x1.377 smd: 1(-1,0) 2(1,0)
SMB_L4.6-W3.6-LS5.3-RD
  rect 2.047x2.192 smd: 1(-2.361,0) 2(2.361,0)
SOP-8_L4.9-W3.9-P1.27-LS6.0-BL-EP
  oval 0.6x1.8 smd: 1(-1.905,-2.772) 2(-0.635,-2.772) 3(0.635,-2.772) 4(1.905,-2.772) 5(1.905,2.772) 6(0.635,2.772) 7(-0.635,2.772) 8(-1.905,2.772)
  rect 2.29x2.29 smd: 9(0,0)
SOT-223-3_L6.5-W3.4-P2.30-LS7.0-BR
  rect 2.5x1.1 smd: 1(2.97,-2.3) 2(2.97,0) 3(2.97,2.3)
  rect 2.34x3.6 smd: 4(-2.97,0)
SW-SMD_L6.0-W3.6-LS8.0
  rect 1.5x1 smd: 1(-3.95,0) 2(3.95,0)
SW-TH_RS601HL-1010011BB
  oval 2x6 hole 1x5: 1(-2.5,0) 2(2.5,0)

## Nets
As in the schematic.

Pads without a net: CN1 3 4; H3 1 6; H6 9 10; H7 1 2 3 4 5 6; NOREF 101; NOREF#2 102; NOREF#3 101; NOREF#4 103; U1 2 3 5; U2 2 3 5; U6 3 4 5 6; U7 3 4 5 6; U8 3 4 5 6; U9 3 4 5 6; U13 1 2 3 4 5 7 15 16 17 18 38 39 40 41 42 43 44 45 46 51 52 53 54 55 56 57 58 66 67 70 71 77 78 79 81 82 84 85 86 87 88 89 90 91

## Via types
v1: diameter 0.61, hole 0.305, Top Layer to Bottom Layer, 24 vias

## Routing (per net, layer and track width the routed paths; a pad name or vN(x,y) marks a point on that pad's centre or on a via; arc(x,y) is an arc through that point)
3.3V: length 227.1
  Top Layer w0.25: U13.21 39.04,50.07 ; 38.87,48.81 39.13,49.07 U13.19 ; U13.28 37.51,52.7
  Top Layer w0.3: 38.87,44.81 38.87,49.91 39.04,50.07 38.62,50.49 38.62,51.59 37.51,52.7 36.12,51.3 27.06,51.3 26.51,51.86 U13.50 26.51,55.1 C32.2 ; 38.87,44.81 39.13,45.07 U13.11 ; 38.87,44.81 38.87,42.41 ; C33.2 38.51,34.98 U13.100 38.51,42.05 38.87,42.41 ; 38.87,42.41 39.03,42.57 U13.6 ; C30.2 22.73,38.84 23.95,40.06 23.95,40.07 U13.75
  Top Layer w0.5: R8.2 43.68,68.59 v1(45.35,66.93) ; R12.1 50.7,56
  Top Layer w1: v1(53.1,57.02) 52.08,56 50.7,56 50.84,55.86 51.59,55.86 52.21,55.24 52.21,34.03 49.03,30.86 39.76,30.86 39.01,31.6 C28.2 ; H1.1 22.73,18.43 C31.2 C30.2 ; v1(15.5,52.83) 16.77,52.83 20.19,56.25 C32.2
  Top Layer w1.199: C28.2 39.01,34.48 C33.2
  Bottom Layer w0.6: v1(45.35,66.93) 45.35,64.77 v1(53.1,57.02)
  Bottom Layer w1: U3.2 13.73,51.05 v1(15.5,52.83)
  Bottom Layer w1.199: 20.08,7.87 H4.10 H4.8 H4.6 H4.4 H4.2 8.14,8.38 8.14,37.83 9.66,39.35 C26.2 10.93,40.71 U3.4 ; 20.08,7.87 22.49,7.87 U12.2 ; 20.08,7.87 24.14,11.93 H1.1 ; C25.2 13.73,39.51 U3.4 ; U3.4 U3.2 ; U3.4 16.22,41.02 R7.2
5V: length 213.6
  Bottom Layer w1.199: H4.1 H4.3 H4.5 H4.7 H4.9 23,1.14 44.2,1.14 49.27,6.21 H3.2 53.08,6.21 H2.4 ; L4.2 19.99,63.98 C17.1 C19.1 C22.1 11.06,62.26 C20.2 11.9,61.83 R4.2 R5.2 19.84,61.83 21.22,60.45 21.22,50.91 21.33,50.8 ; 21.33,50.8 16.9,50.8 16.02,49.92 U3.3 ; 21.33,50.8 C23.1 ; 60.33,18.54 H2.10 56.78,18.54 55.38,17.14 55.38,13.33 H2.4 ; H2.4 60.33,10.92
  Bottom Layer w1.2: H4.1 6.49,7.49 6.49,41.4 4.83,43.05 4.2,43.05 H8.4
  Bottom Layer w1.3: U3.3 16.02,48.49 47.51,17 47.51,8.63 50.06,6.08
12V: length 69.4
  Bottom Layer w1.199: R2.2 41.81,57.49 57.67,41.63 57.67,35.43 H9.10 H9.8 H9.6 H9.2 ; R1.2 36.3,62.72 C9.1 C6.1 C8.1 C7.1 36.44,70.74 37.98,70.74 40.75,67.97 L3.2
  Bottom Layer w1.2: R1.2 37.35,59.81 38.22,58.94 C10.2 ; 38.87,58.29 R2.2
16V: length 171.2
  Bottom Layer w1: 46.89,73.02 50.09,73.02 51.29,74.22 51.29,78.12
  Bottom Layer w1.199: U2.7 13.22,79.2 11.38,81.03 C15.1 C14.1 C12.1 C13.1 21.94,84.04 D3.1 28.3,82.73 SW2.2 32.94,82.43 D1.1 37.4,77.97 50.79,77.97 C4.1 52.86,78.12 53.28,78.54 ; U7.1 58.1,82.53 arc(57.34,82.38) 56.69,81.95 53.28,78.54 ; 53.28,78.54 arc(52.81,78.23) 52.26,78.12
  Bottom Layer w1.2: U6.1 1.53,30.72 1.53,63.48 U8.1 2.17,66.91 2.17,82.29 3.91,84.04 C15.1 ; U9.1 62.24,58.67 60.52,60.38 arc(60.01,61.16) 59.83,62.07 59.83,80.12 U7.1
GND: length 7.4
  Top Layer w0.249: U13.10 v1(41.67,44.57) ; U13.99 38.01,39.72 v1(37.86,39.87) ; U13.27 37.98,53.65 v1(37.98,54.73) ; U13.20 41.46,49.57 v1(41.54,49.65) ; U13.74 v1(26.68,40.57)
BOOT0: length 5.2
  Top Layer w0.201: U13.94 35.51,34.46 R9.1
BOOT1: length 6.9
  Top Layer w0.201: v1(32.77,54.86) 33.01,54.63 U13.37 ; v1(30.49,57.15) 30.49,57.64 R10.1
  Bottom Layer w0.201: v1(32.77,54.86) 31.25,54.86 30.74,55.37 30.74,56.89 v1(30.49,57.15)
GPIO1: length 47.8
  Top Layer w0.201: U13.29 37.01,58.37 11.82,83.56 6.87,83.56 H6.1
GPIO2: length 43.2
  Top Layer w0.201: H6.5 6.43,78.04 15.06,78.04 35.01,58.09 U13.33
GPIO3: length 39
  Top Layer w0.201: H6.6 15.82,76.7 34.51,58.02 U13.34
GPIO4: length 36.9
  Top Layer w0.201: U13.36 33.51,57.88 17.57,73.82 7.98,73.82 H6.8
I2C1_SCL: length 37.1
  Top Layer w0.201: U13.92 34.51,36.53 v1(29.35,31.37)
  Bottom Layer w0.201: v1(29.35,31.37) 29.35,3.55
I2C1_SDA: length 37.5
  Top Layer w0.201: v1(30.36,31.49) 35.01,36.14 U13.93
  Bottom Layer w0.201: v1(30.36,31.49) 30.36,5.08 U12.4
KEY1: length 17.1
  Top Layer w0.201: SW3.1 38.67,23.78 38.67,27.93 36.51,30.09 U13.96
KEY2: length 11.9
  Top Layer w0.201: SW5.1 36.01,28.91 U13.95
KEY3: length 12.5
  Top Layer w0.201: U13.97 37.01,30.16 39.86,27.3 SW4.1
KEY4: length 17.9
  Top Layer w0.201: SW6.1 40.39,22.73 41.23,23.56 41.23,27.75 37.51,31.47 U13.98
LED: length 4.2
  Top Layer w0.201: U13.65 24.95,45.08 23.25,45.08 22.23,46.1 21.58,46.1 21.33,45.84
OSC32_IN: length 12.7
  Top Layer w0.201: U13.8 40.89,43.57 41.42,43.04 41.42,37.32 43.32,35.43 45.85,35.43 X1.2
OSC32_OUT: length 14.1
  Top Layer w0.201: X1.1 48.53,35.93 45.37,39.09 43.09,39.09 41.82,40.36 41.82,43.22 40.96,44.07 U13.9
OSC_IN: length 11
  Top Layer w0.201: X2.2 44.72,42.77 44.34,43.15 44.34,44.7 42.86,44.7 42.04,45.52 40.11,45.52 U13.12
OSC_OUT: length 13.1
  Top Layer w0.201: 44.33,49.29 41.11,46.07 U13.13 ; 44.33,49.29 47.39,49.29 X2.1 ; 44.33,49.29 44.34,49.28 44.34,47.18
RESET: length 30.2
  Top Layer w0.201: v1(39.76,57.02) 43.57,60.83 43.57,64.91 SW1.2 43.46,67.06 R8.1 38.86,68.83 C27.2 ; U13.14 40.96,46.57 41.54,47.15 v1(41.54,47.37)
  Bottom Layer w0.201: v1(41.54,47.37) 42.43,48.26 42.43,54.35 v1(39.76,57.02)
SPI1_SCK: length 43.3
  Top Layer w0.201: U13.30 36.51,58.3 13.15,81.66 7.76,81.66 H6.2
SWCLK: length 28.4
  Top Layer w0.201: U13.76 26.51,16.08 25.66,15.24 23.38,15.24 H1.2
SWDIO: length 33.2
  Top Layer w0.201: U13.72 18.34,41.57 16.27,39.49 16.27,19.81 H1.3
TIM3_CH1: length 45.3
  Top Layer w0.201: U13.31 36.01,58.23 13.66,80.58 6.43,80.58 H6.3
TIM3_CH2: length 41.2
  Top Layer w0.201: H6.4 14.42,79.24 35.51,58.16 U13.32
TIM3_CH3: length 41.6
  Top Layer w0.201: H6.7 6.36,75.43 8.64,75.43 9.41,76.2 15.76,76.2 34.01,57.95 U13.35
TIM4_CH1: length 59.8
  Top Layer w0.201: 60.33,8.38 59.01,9.7 57.23,9.7 54.24,12.7 v1(54.24,18.67) ; v1(23,48.51) 23.43,48.07 U13.59
  Bottom Layer w0.201: v1(23,48.51) 24.77,48.51 54.24,19.05 v1(54.24,18.67)
TIM4_CH2: length 55.6
  Top Layer w0.201: U13.60 23.71,47.57 v1(23.5,47.37) ; v1(53.1,18.67) 53.1,13.08 H2.2
  Bottom Layer w0.201: v1(53.1,18.67) 53.1,19.3 25.03,47.37 v1(23.5,47.37)
TIM4_CH3: length 49.8
  Top Layer w0.201: v1(56.14,19.81) 58.3,19.81 59.13,18.98 59.13,17.2 60.33,16 ; v1(28.84,47.11) 25,47.11 U13.61
  Bottom Layer w0.201: v1(28.84,47.11) 29.47,46.48 29.47,45.74 55.41,19.81 v1(56.14,19.81)
TIM4_CH4: length 45.9
  Top Layer w0.201: v1(55.38,18.92) 55.38,18.41 H2.8 ; v1(28.33,46.1) 27.86,46.57 U13.62
  Bottom Layer w0.201: v1(55.38,18.92) 55.38,19.05 v1(28.33,46.1)
UART4_RX: length 42.5
  Top Layer w0.201: U9.8 63.01,40.65 63.58,41.22 63.58,43.48 62.62,44.45 61.6,44.45 60.71,45.34 60.71,52.07 53.48,59.31 46.62,59.31 43.8,56.49 43.8,54.11 41.26,51.57 U13.24
UART4_TX: length 37.2
  Top Layer w0.201: U9.7 60.31,45.08 60.31,51.84 53.32,58.83 46.71,58.83 44.2,56.32 44.2,53.94 41.33,51.07 U13.23
UART5_RX: length 55
  Top Layer w0.201: U13.83 30.01,37.24 28.23,35.45 28.23,16.29 31.67,12.85 33.81,12.85 36.08,15.11 50.55,15.11 51.44,14.22 51.44,10.13 H3.3
UART5_TX: length 46.9
  Top Layer w0.201: H3.4 48.91,12.44 31.51,12.44 27.82,16.13 27.82,36.49 28.51,37.18 U13.80
USART1_RX: length 44.7
  Top Layer w0.201: U6.8 4.59,11.06 15.86,22.33 15.86,39.66 18.18,41.97 23.06,41.97 24.16,43.07 U13.69
USART1_TX: length 43.9
  Top Layer w0.201: U13.68 23.9,43.57 22.71,42.38 18.01,42.38 15.46,39.83 15.46,22.49 6.52,13.56 U6.7
USART2_RX: length 36
  Top Layer w0.201: U7.8 63.01,65.03 63.51,65.53 63.51,68.07 62.87,68.7 52.84,68.7 38.51,54.37 U13.26
USART2_TX: length 31.1
  Top Layer w0.201: U7.7 52.31,67.53 43.32,58.54 43.32,54.2 41.19,52.07 U13.25
USART3_RX: length 44.9
  Top Layer w0.201: U13.48 27.51,54.54 27.7,54.72 30.73,54.72 31.12,55.11 31.12,58.92 30.36,59.69 20.33,59.69 12.38,51.74 3.16,51.74 2.17,50.75 2.17,49.41 U8.8
USART3_TX: length 31.2
  Top Layer w0.201: v1(24.14,53.97) 22.36,53.97 14.87,46.48 7.6,46.48 U8.7 ; v1(27.7,52.19) 28.01,52.51 U13.47
  Bottom Layer w0.201: v1(27.7,52.19) 25.92,53.97 v1(24.14,53.97)
USART6_RX: length 25.7
  Top Layer w0.201: U13.64 23.52,45.57 21.61,47.48 18.29,47.48 8.64,37.84 H8.2
USART6_TX: length 26.2
  Top Layer w0.201: H8.3 5.83,38.63 8.86,38.63 18.11,47.88 21.79,47.88 23.59,46.07 U13.63
$1N1025: length 12.8
  Bottom Layer w0.6: 53.22,68.97 52.98,69.21 44.08,69.21 41.56,71.73 U1.1
$1N1287: length 19.5
  Bottom Layer w0.6: L3.1 54.54,65.02 D2.1 56.02,69.47 54.13,71.35 52.84,71.35 52.44,71.75 46.85,71.75
$1N2006: length 36.2
  Bottom Layer w0.6: R1.1 32.92,58.29 36.08,58.29 38.36,56 ; R1.1 31.39,71.39 35.57,75.56 41.81,75.56 ; R1.1 31.39,57.13 31.9,56.62 31.9,56.11
$1N2167: length 3.7
  Bottom Layer w0.6: R2.1 47.35,58.29 LED1.1
$1N3876: length 10.9
  Bottom Layer w0.6: U2.1 14.49,70.74 15.12,70.1 17.28,70.1 17.92,70.74 C16.2
$1N3877: length 13.5
  Bottom Layer w0.5: D4.1 21.51,78.22 L4.1
  Bottom Layer w0.6: 18.04,78.21 21.29,78.21 D4.1
  Bottom Layer w0.8: 17.54,78.21 15.6,78.21 arc(15.14,78.12) 14.76,77.86 14.61,77.72
  Bottom Layer w1: 18.04,78.21 C16.1
$1N3883: length 23.4
  Bottom Layer w0.5: C20.1 C21.2 15.03,56.96 ; R6.2 15.03,59.74 R4.1
  Bottom Layer w0.6: U2.4 10.68,70.86 8.77,68.96 8.77,62.23 11.37,59.63 C20.1
$1N3893: length 2.9
  Bottom Layer w0.5: R5.1 LED2.1
$1N6099: length 3.1
  Bottom Layer w0.5: LED3.1 16.22,34.71 R7.1
$1N9952: length 16.6
  Bottom Layer w1.199: CN1.2 50.14,87.37 SW2.1
$1N10073: length 3.2
  Top Layer w0.201: 19.33,45.84 21.25,43.92 21.25,43.43
$1N17348: length 2.7
  Top Layer w0.201: U13.49 27.01,55.17 27.84,56
$1N17426: length 4.3
  Top Layer w0.201: C40.1 22.02,41.07 U13.73
$1N39852: length 11.9
  Top Layer w0.25: U13.22 41.44,50.57 44.73,53.86 C42.2 R12.2

## Copper pours and planes (outline as drawn; the poured copper is in the pictures)
GND on Top Layer: -5.33,97.28 67.95,97.28 67.95,-1.65 -5.33,-1.65
GND on Bottom Layer: -1.77,94.61 66.43,94.61 66.43,-0.38 -1.77,-0.38

Small or netless copper shapes (teardrops, artwork), in the pictures only: 129 on Top Layer, 163 on Bottom Layer

## Text on the board
Top Silkscreen Layer: 5V | U6_TX | U6_RX | GND | 16V | U3_TX | U3_RX | U1_TX | U1_RX | GPIO1 | SPI1_SCK | TIM3_CH1 | TIM3_CH2 | GPIO2 | GPIO3 | TIM3_CH3 | GPIO4 | SWDIO | SWCLK | 3.3V | U2_TX | U4_TX | U2_RX | U4_RX | U5_TX | U5_RX | TIM4_CH3 | TIM4_CH1 | TIM4_CH2 | 12V | I2C1_SCL | I2C1_SDA
